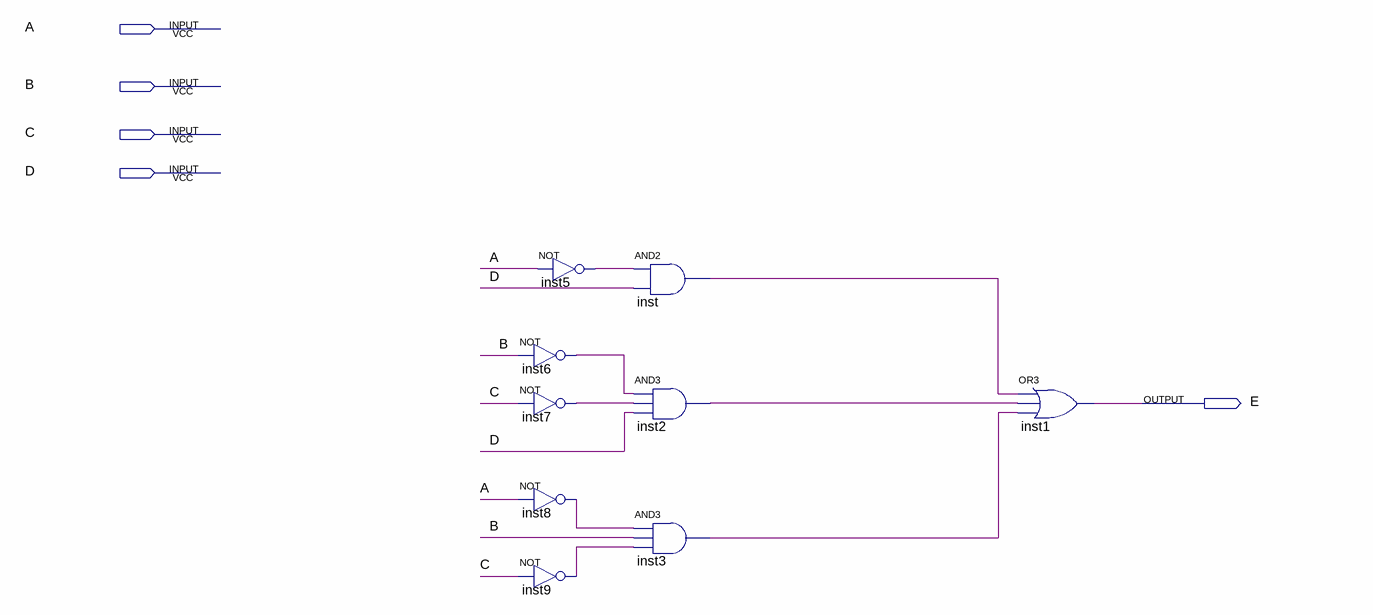
[diagram p0: schematic sheet]
// Quartus schematic E.bdf as structural Verilog: 9 symbols, 5 pins
module E (
  input  A,
  input  B,
  input  C,
  input  D,
  output E
);

  wire inst2_out, inst3_out, inst5_out, inst6_out, inst7_out, inst8_out, inst9_out, inst_out;

  not inst5 (inst5_out, A);
  not inst6 (inst6_out, B);
  not inst7 (inst7_out, C);
  not inst8 (inst8_out, A);
  not inst9 (inst9_out, C);
  and inst (inst_out, inst5_out, D);
  and inst2 (inst2_out, inst6_out, inst7_out, D);
  and inst3 (inst3_out, inst8_out, B, inst9_out);
  or inst1 (E, inst_out, inst2_out, inst3_out);
endmodule
